# EasyEDA Pro project ProPrj_Enviromental_Sensor_2025-12-07.epro

# Board PCB1
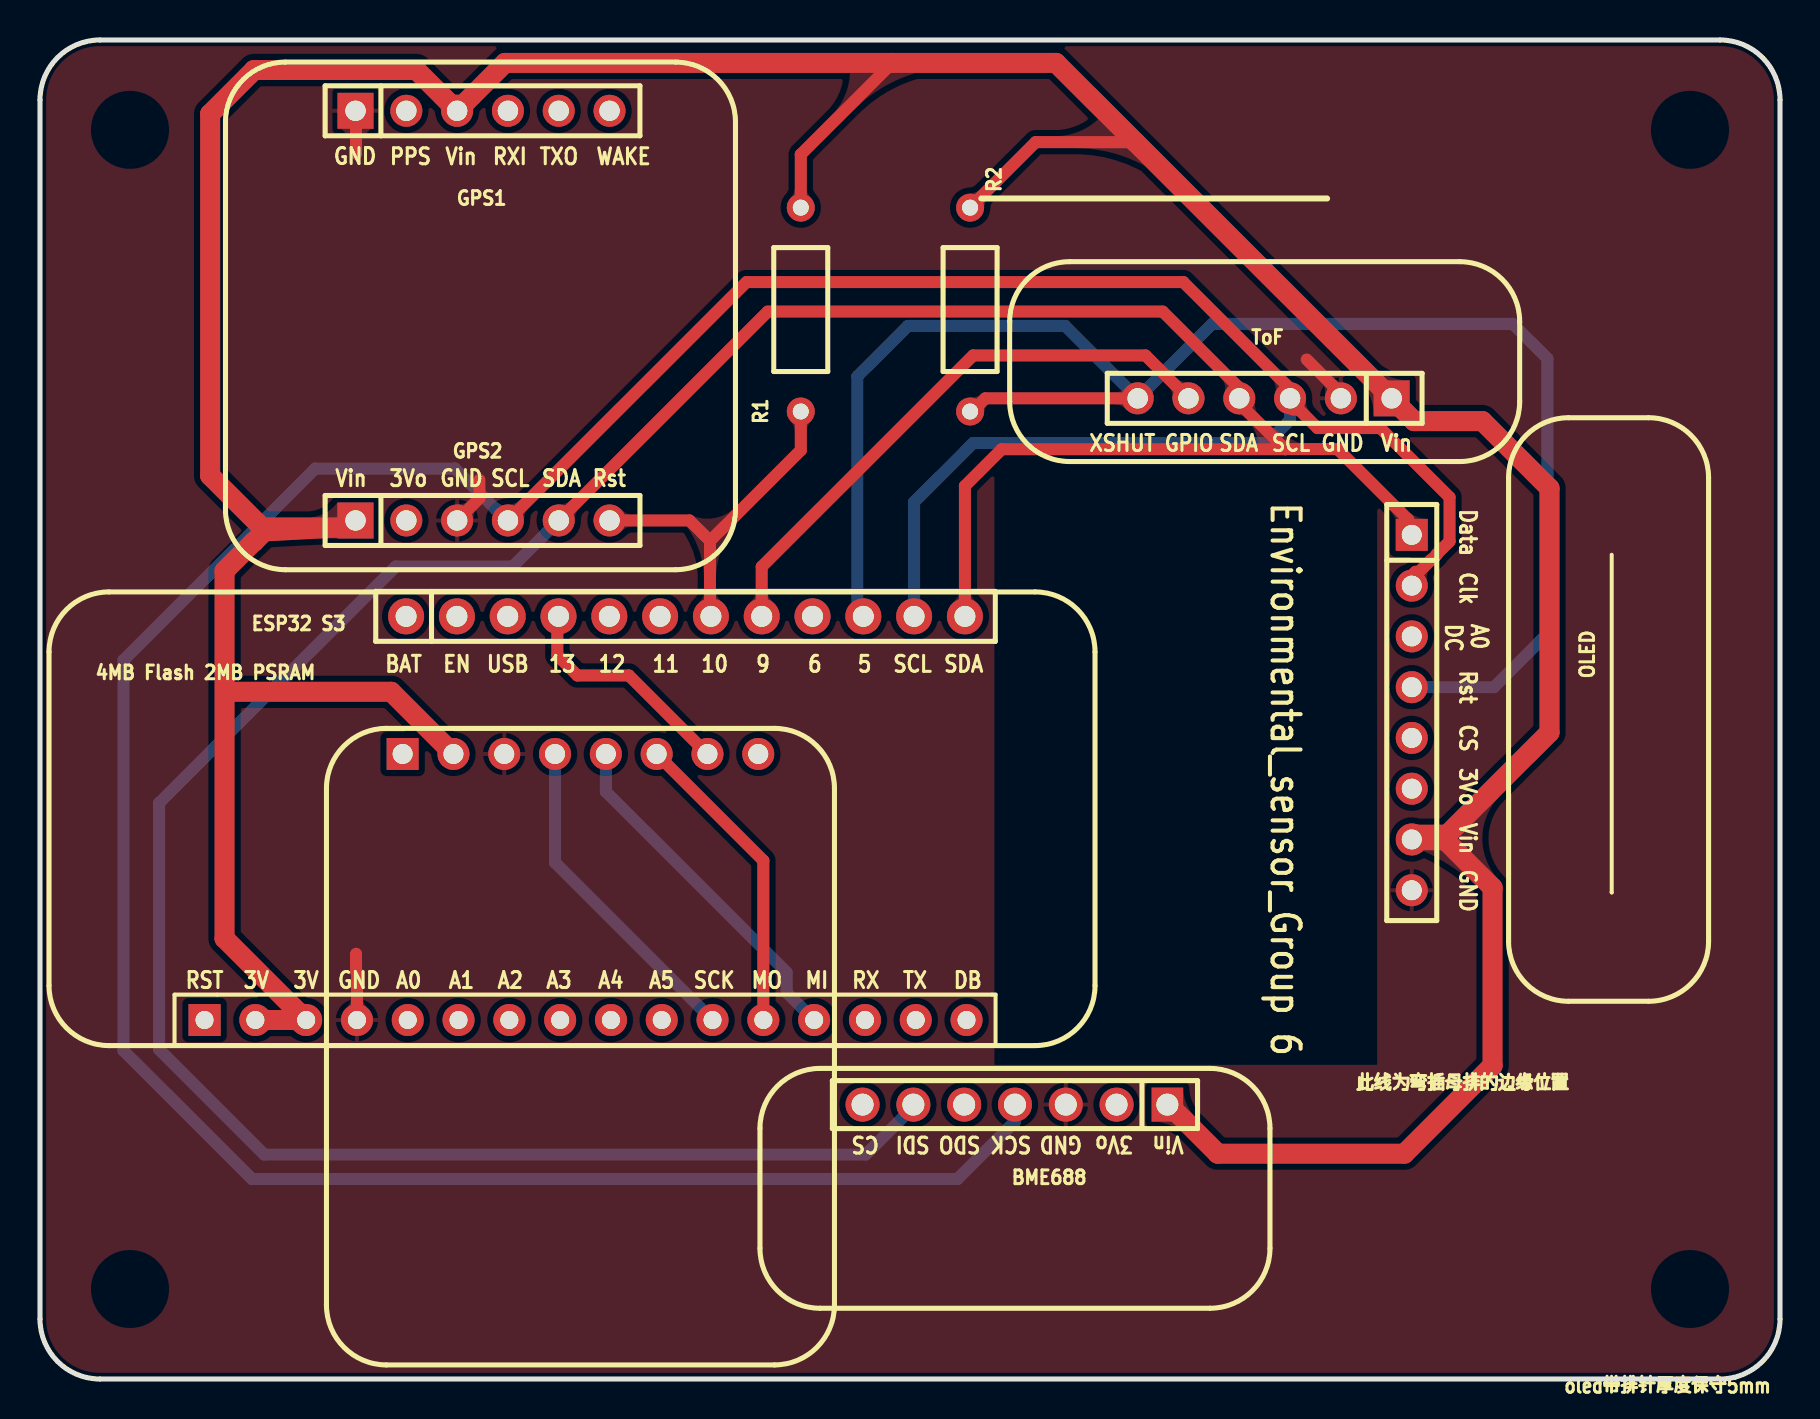
[diagram p0: board, top side]
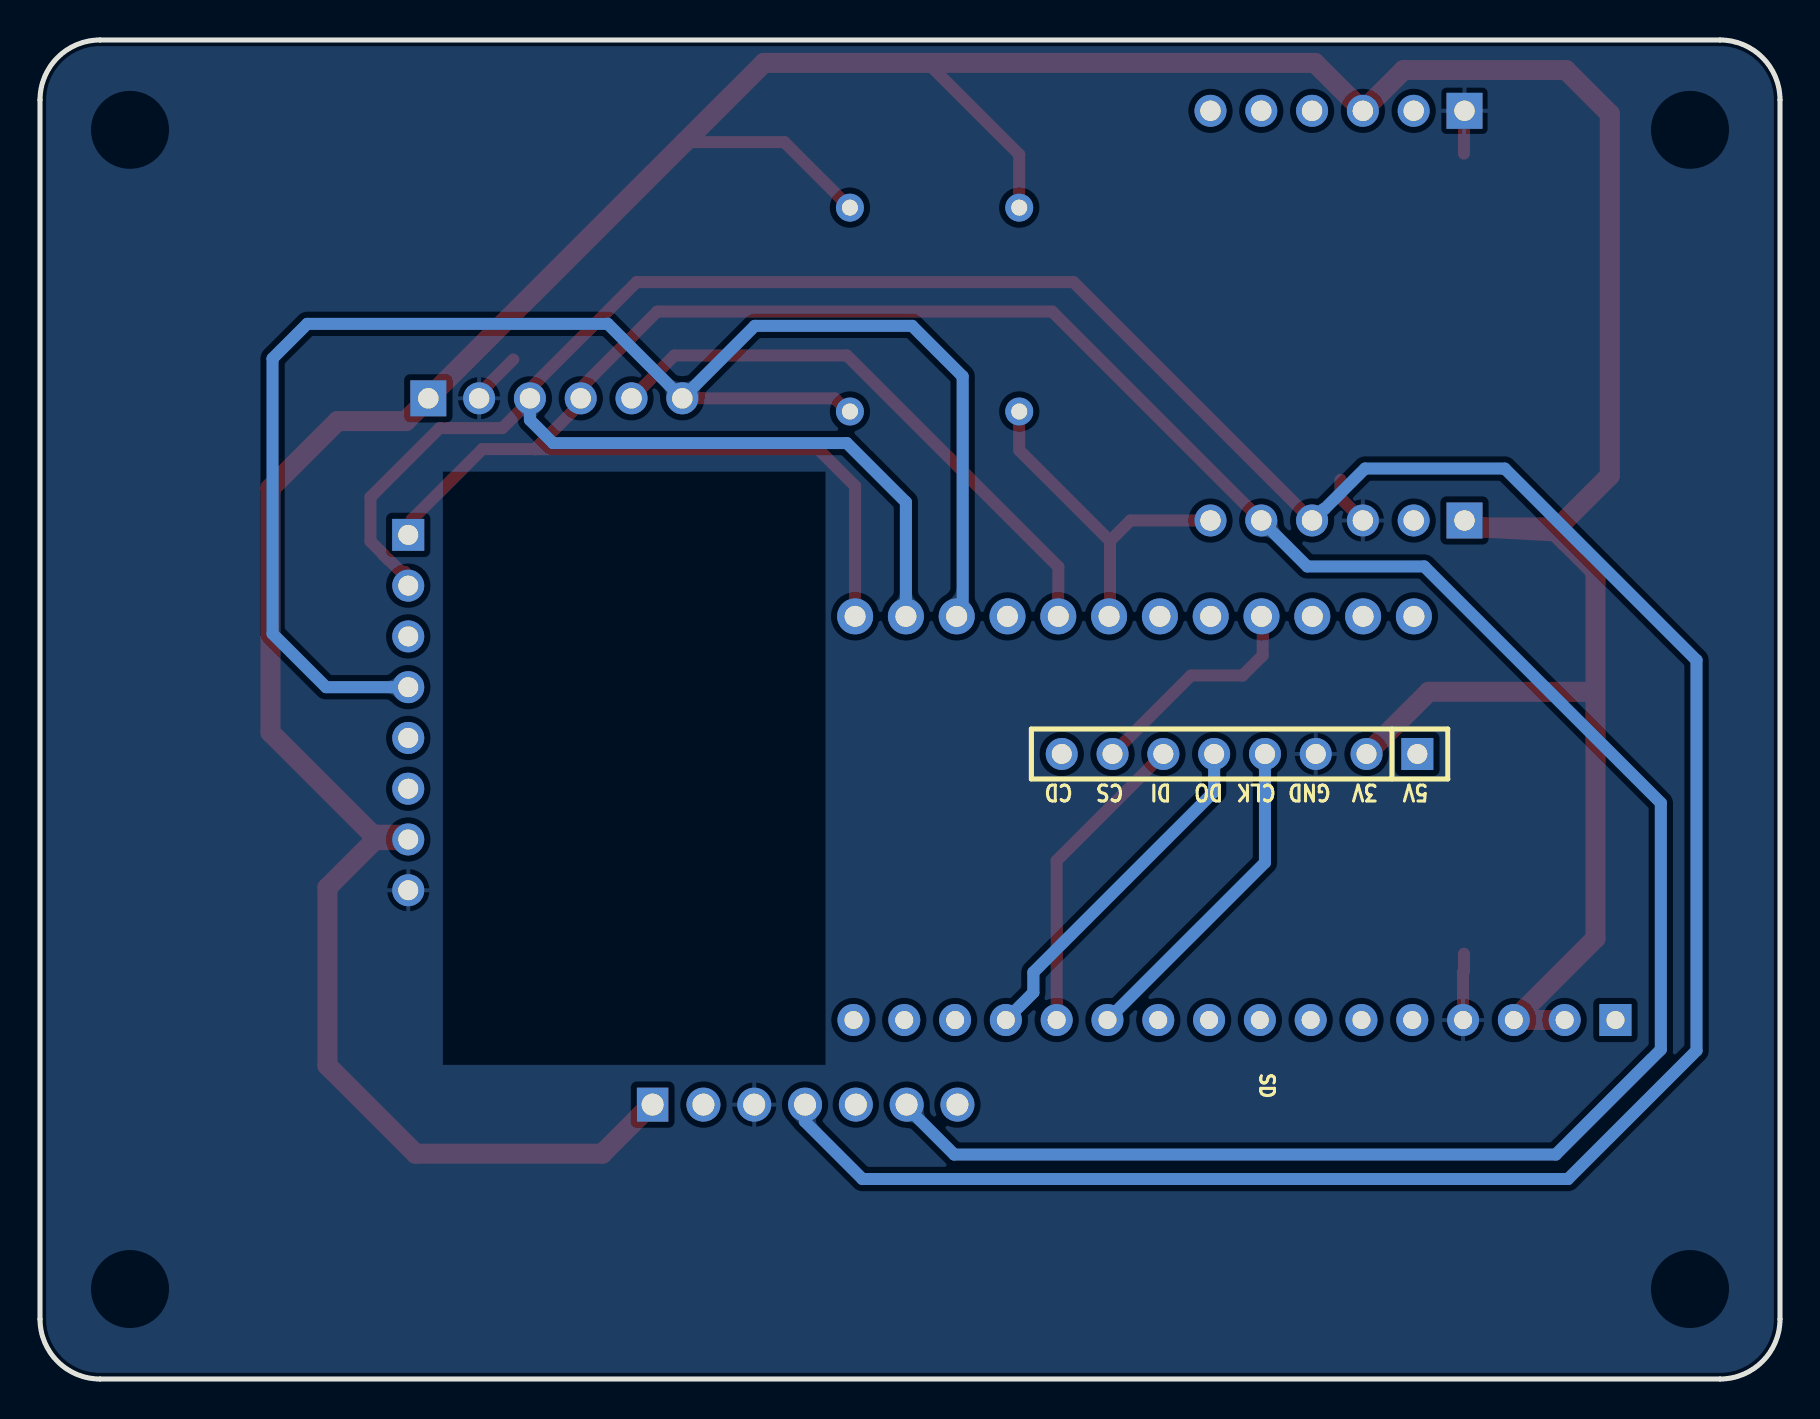
[diagram p1: board, bottom side, seen from below]

Outline 87 x 67 mm; copper layers: Top Layer, Bottom Layer. Coordinates in mm from the lower left corner of the outline.
Outline path: 0,64 0,3 arc(0.88,0.88) 3,0 84,0 arc(86.12,0.88) 87,3 87,64 arc(86.12,66.12) 84,67 3,67 arc(0.88,66.12) 0,64
Stack: Top Layer 0.035mm / Dielectric1 1.51mm FR4 er 4.5 / Bottom Layer 0.035mm

## Design rules (mm)
template: 自定义配置
spacing copperThickness1oz: track to track 0.102, other pairs 0.152 to 0.3
spacing copperThickness2oz (default): track to track 0.203, other pairs 0.152 to 0.3
spacing safeClearance: track to track 0.2, other pairs 0.152 to 0.3
track width copperThickness1oz (default): min 0.127, default 0.254, max 2.54
track width copperThickness2oz: min 0.203, default 0.254, max 2.54
track width trackWidth: min 0.127, default 0.254, max 2.54
differential pair differentialPair (default): width min 0.127, default 0.232, max 2.54; gap min 0.152, default 0.152
via viaSize (default): diameter min 0.5, default 0.61, max 10; hole min 0.3, default 0.305, max 6

## Placement (name value [footprint] x y rotation side)
4MB Flash 2MB PSRAM  ZX-PM2.54-1-16PY  [HDR-TH_16P-P2.54-V-F-1]  27.28 17.96 0 top
BME688  PM254V-11-07-H85  [HDR-TH_7P-P2.54-V-F]  48.75 13.73 180 top
ESP32 S3  ZX-PM2.54-1-12PY  [HDR-TH_12P-P2.54-V-F]  32.28 38.16 0 top
GPS1  PM254V-11-06-H85  [HDR-TH_6P-P2.54-V-F]  22.13 63.46 0 top
GPS2  PM254V-11-06-H85  [HDR-TH_6P-P2.54-V-F]  22.13 42.96 0 top
OLED  2.54-1*8P母环保  [HDR-TH_8P-P2.54-V-F_2]  68.59 33.35 270 top
R1  1kΩ  [RES-TH_BD2.7-L6.2-P10.20-D0.4]  38.04 53.51 90 top
R2  1kΩ  [RES-TH_BD2.7-L6.2-P10.20-D0.4]  46.5 53.51 270 top
SD  2.54-1*8P母环保  [HDR-TH_8P-P2.54-V-F_2]  27.02 31.27 0 bottom
ToF  PM254-1-06-W-8.5  [HDR-TH_6P-P2.54-V-F]  61.23 49.07 180 top

## Footprints (pads in the part's own frame, mm; a bottom-side part is the same pattern mirrored in y, then rotated)
HDR-TH_6P-P2.54-V-F
  rect 1.8x1.8 hole 1.02: 1(-6.35,0)
  round 1.6 hole 1.02: 2(-3.81,0) 3(-1.27,0) 4(1.27,0) 5(3.81,0) 6(6.35,0)
HDR-TH_7P-P2.54-V-F
  rect 1.575x1.7 hole 1.1: 1(-7.62,0)
  round 1.7 hole 1.1: 2(-5.08,0) 3(-2.54,0) 4(0,0) 5(2.54,0) 6(5.08,0) 7(7.62,0)
HDR-TH_8P-P2.54-V-F_2
  rect 1.6x1.6 hole 1: 1(-8.89,0)
  round 1.6 hole 1: 2(-6.35,0) 3(-3.81,0) 4(-1.27,0) 5(1.27,0) 6(3.81,0) 7(6.35,0) 8(8.89,0)
HDR-TH_12P-P2.54-V-F
  round 1.8 hole 1.05: 1(-13.97,0) 2(-11.43,0) 3(-8.89,0) 4(-6.35,0) 5(-3.81,0) 6(-1.27,0) 7(1.27,0) 8(3.81,0) 9(6.35,0) 10(8.89,0) 11(11.43,0) 12(13.97,0)
HDR-TH_16P-P2.54-V-F-1
  rect 1.6x1.6 hole 0.9: 1(-19.05,0)
  round 1.6 hole 0.9: 2(-16.51,0) 3(-13.97,0) 4(-11.43,0) 5(-8.89,0) 6(-6.35,0) 7(-3.81,0) 8(-1.27,0) 9(1.27,0) 10(3.81,0) 11(6.35,0) 12(8.89,0) 13(11.43,0) 14(13.97,0) 15(16.51,0) 16(19.05,0)
RES-TH_BD2.7-L6.2-P10.20-D0.4
  round 1.4 hole 0.8: 1(-5.1,0) 2(5.1,0)

## Nets
GND: 4MB Flash 2MB PSRAM.4 BME688.3 GPS1.1 GPS2.3 OLED.8 SD.3 ToF.2
3P3: 4MB Flash 2MB PSRAM.2 4MB Flash 2MB PSRAM.3 BME688.1 GPS1.3 GPS2.1 OLED.7 R1.2 R2.1 SD.2 ToF.1
CS: ESP32 S3.4 SD.7
GPIO: ESP32 S3.8 ToF.5
GPSRST: ESP32 S3.7 GPS2.6 R1.1
IO: 4MB Flash 2MB PSRAM.13 SD.5
OI: 4MB Flash 2MB PSRAM.12 SD.6
RST: ESP32 S3.10 OLED.4 R2.2 ToF.6
SCK: 4MB Flash 2MB PSRAM.11 SD.4
SCL: BME688.4 ESP32 S3.11 GPS2.4 OLED.2 ToF.3
SDA: BME688.6 ESP32 S3.12 GPS2.5 OLED.1 ToF.4

Pads without a net: 4MB Flash 2MB PSRAM 1 5 6 7 8 9 10 14 15 16; BME688 2 5 7; ESP32 S3 1 2 3 5 6 9; GPS1 2 4 5 6; GPS2 2; OLED 3 5 6; SD 1 8

## Routing (per net, layer and track width the routed paths; a pad name or vN(x,y) marks a point on that pad's centre or on a via; arc(x,y) is an arc through that point)
GND: length 10.6
  Top Layer w0.6: GPS1.1 15.8,63.43 15.8,61.31 ; 63.34,51.01 65.04,49.3 ToF.2 ; 4MB Flash 2MB PSRAM.4 15.85,20.36 15.8,20.41 15.8,21.28 ; 21.97,44.99 21.97,44.07 GPS2.3
3P3: length 223.1
  Top Layer w0.6: R2.1 49.78,61.89 54.76,61.89 ; 42.62,65.85 38.04,61.27 R1.2
  Top Layer w1: 9.68,34.39 17.56,34.39 SD.2 ; GPS2.1 15.43,42.61 14.94,42.61 ; ToF.1 50.8,65.85 23.25,65.85 GPS1.3 18.82,65.5 10.7,65.5 8.51,63.3 8.51,45.2 11.1,42.61 14.94,42.61 ; 4MB Flash 2MB PSRAM.2 4MB Flash 2MB PSRAM.3 9.23,22.04 9.23,40.43 10.7,41.9 10.71,41.9 11.22,42.41 14.94,42.61 ; 56.35,13.82 58.89,11.27 68.22,11.27 72.63,15.68 72.63,24.59 70.25,26.96 69.07,26.96 ; 67.69,48.95 68.71,47.93 72.12,47.93 75.48,44.58 75.48,32.35 70.36,27.24 68.53,27.24
CS: length 11.5
  Top Layer w0.6: SD.7 29.45,35.2 26.87,35.2 25.87,36.2 25.87,38.1 ESP32 S3.4
GPIO: length 29.1
  Top Layer w0.6: ToF.5 55.28,51.22 46.66,51.22 36.09,40.64 ESP32 S3.8
GPSRST: length 17.6
  Top Layer w0.6: 33.5,41.93 33.5,38.21 ESP32 S3.7 ; 33.5,41.93 38.04,46.47 R1.1 ; 33.5,41.93 32.47,42.96 GPS2.6
IO: length 17.6
  Bottom Layer w0.6: SD.5 28.29,29.39 37.33,20.35 37.33,19.34 4MB Flash 2MB PSRAM.13
OI: length 15.5
  Top Layer w0.6: 4MB Flash 2MB PSRAM.12 36.17,25.94 SD.6
RST: length 81.7
  Top Layer w0.6: 46.56,48.36 47.27,49.07 ToF.6
  Bottom Layer w0.6: OLED.4 72.7,34.62 75.37,37.29 75.37,51.06 73.64,52.8 58.61,52.8 ToF.6 51.26,52.69 43.39,52.69 40.87,50.17 40.87,38.46 ESP32 S3.10
SCK: length 16.6
  Bottom Layer w0.6: 4MB Flash 2MB PSRAM.11 25.75,25.84 SD.4
SCL: length 181.7
  Top Layer w0.6: ToF.3 62.5,49.55 57.16,54.89 35.33,54.89 GPS2.4 ; 68.5,40.11 68.78,40.39 68.95,40.39 69.55,40.98 69.58,40.98 69.84,41.25 69.84,41.28 70.48,41.91 70.48,44.12 67.01,47.58 63.88,47.58 62.95,48.51 62.65,48.51
  Bottom Layer w0.6: GPS2.4 22.84,43.52 22.78,43.52 20.75,45.55 13.76,45.55 4.17,35.97 4.17,16.43 10.6,10.01 45.87,10.01 48.75,12.88 BME688.4 ; ESP32 S3.11 43.71,43.88 46.66,46.83 61.35,46.83 62.5,47.99 ToF.3
SDA: length 154.9
  Top Layer w0.6: 60.19,48.59 62.26,46.52 ; 62.26,46.52 62.26,46.53 64.88,46.53 68.42,42.99 68.42,42.32 ; 62.26,46.52 48.09,46.52 46.25,44.68 ESP32 S3.12 ; GPS2.5 36.39,53.41 56.14,53.41 60.22,49.33 60.22,49.32 ToF.4 60.32,48.72
  Bottom Layer w0.6: GPS2.5 23.64,40.66 17.79,40.66 5.96,28.83 5.96,16.48 11.21,11.23 41.29,11.23 43.67,13.61 BME688.6

## Copper pours and planes (outline as drawn; the poured copper is in the pictures)
GND on Top Layer: -16.33,74.73 119.84,74.73 119.84,-12.64 -16.33,-12.64
GND on Bottom Layer: -8.89,75.39 104.65,75.39 104.65,-8.25 -8.89,-8.25

Small or netless copper shapes (teardrops, artwork), in the pictures only: 37 on Top Layer, 9 on Bottom Layer

## Text on the board
Bottom Silkscreen Layer: 5V | 3V | GND | CLK | DO | DI | CS | CD
Document Layer: 此线为弯插母排的边缘位置
Top Silkscreen Layer: RST | 3V | GND | BAT | A0 | EN | A1 | USB | A2 | A3 | 13 | A4 | 12 | A5 | 11 | SCK | 10 | MO | 9 | MI | 6 | RX | 5 | SCL | TX | SDA | DB | CS | SDI | SDO | 3Vo | Vin | PPS | RXI | TXO | Rst | WAKE | A0 / DC | Data | Clk | XSHUT | GPIO | Environmental_sensor_Group 6 | 此线为弯插母排的边缘位置 | oled带排针厚度保守5mm
